# Altium schematic sheet ST_LINK_V2.SCHDOC: ST-LINK/V2 (SWD only)
size A4; DocumentNumber: 2; SheetNumber: 3; SheetTotal: 7
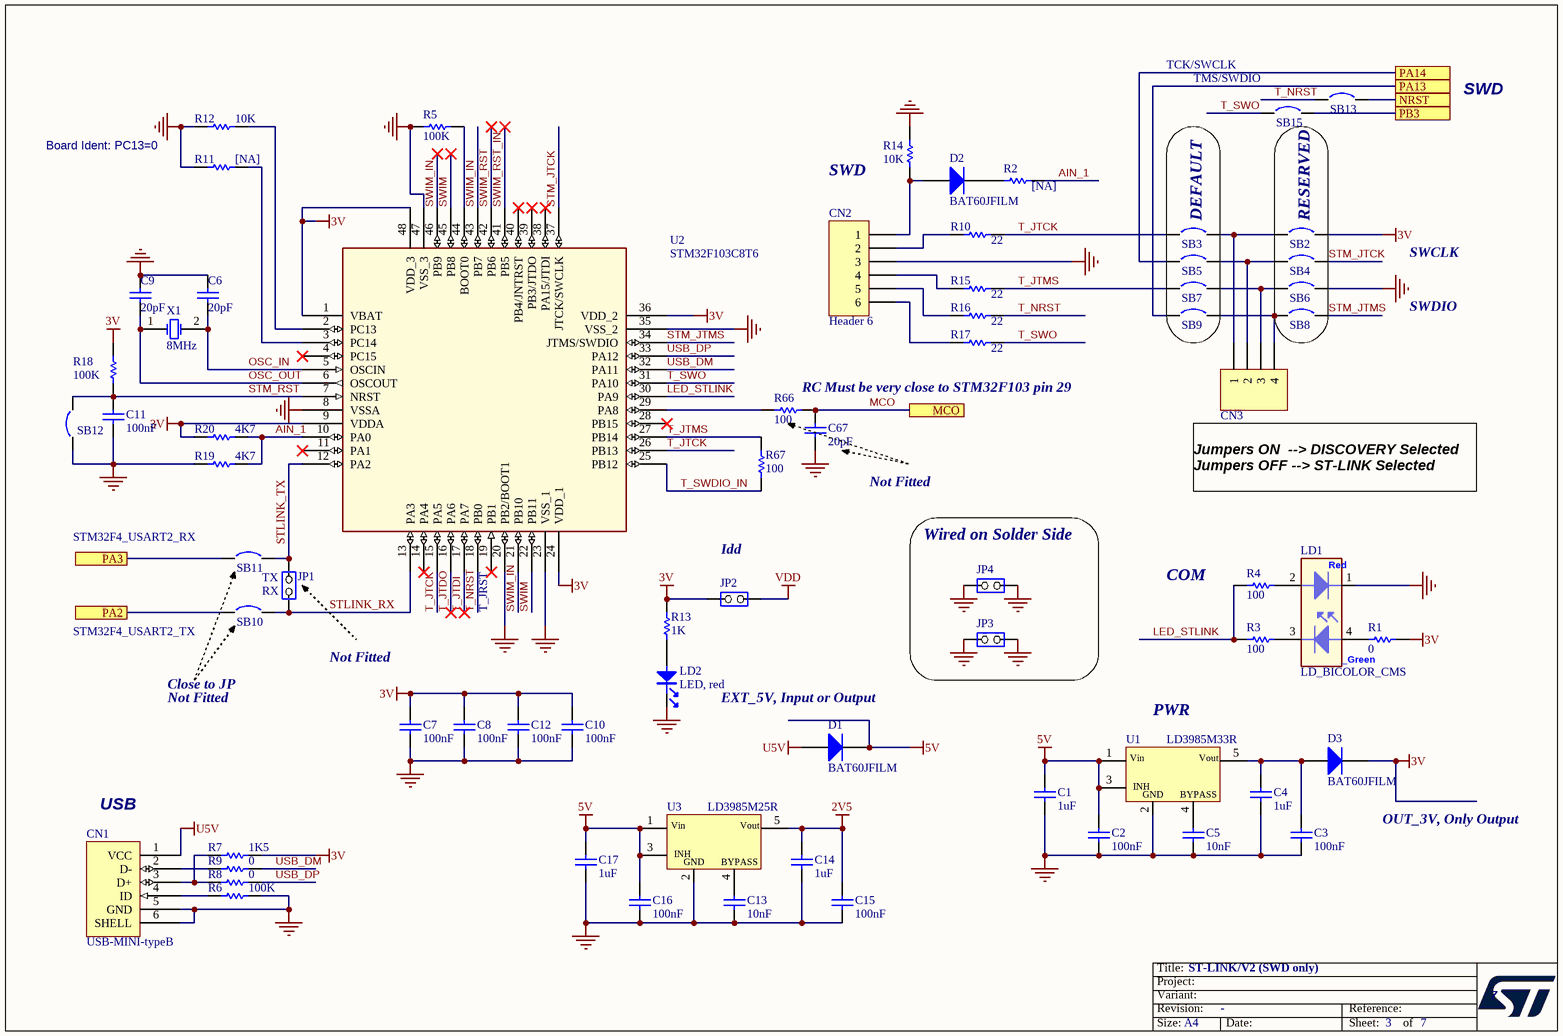
[diagram p0: ST_LINK_V2.SCHDOC]

## Parts
C1  1uF  [0603C (Primary)]
C2  100nF  [0402C (Primary)]
C3  100nF  [0402C (Primary)]
C4  1uF  [0603C (Primary)]
C5  10nF  [0603C (Primary)]
C6  20pF  [0402C (Primary)]
C7  100nF  [0402C (Primary)]
C8  100nF  [0402C (Primary)]
C9  20pF  [0402C (Primary)]
C10  100nF  [0402C (Primary)]
C11  100nF  [0402C (Primary)]
C12  100nF  [0402C (Primary)]
C13  10nF  [0603C (Primary)]
C14  1uF  [0603C (Primary)]
C15  100nF  [0402C (Primary)]
C16  100nF  [0402C (Primary)]
C17  1uF  [0603C (Primary)]
C67  20pF  [0402C (Primary)]
CN1  USB-MINI-typeB  [USB-MINI-B-SMD (Primary)]
CN2  Header 6  [HDR1X6 (Primary)]
CN3  Header 4  [Header 4 (Primary)]  (value not drawn)
D1  BAT60JFILM  [SOD323/A (Primary)]
D2  BAT60JFILM  [SOD323/A (Primary)]
D3  BAT60JFILM  [SOD323/A (Primary)]
JP1  JP2  [SIP2/2.54 (Primary)]  (value not drawn)
JP2  (no value)  [SIP2/2.54 (Primary)]
JP3  (no value)  [SIP2/2.54 (Primary)]
JP4  (no value)  [SIP2/2.54 (Primary)]
LD1  LD_BICOLOR_CMS  [HSMF-A201 (Primary)]
LD2  LED, red  [0603D (Primary)]
R1  0  [0402R (Primary)]
R2  [NA]  [0402R (Primary)]
R3  100  [0402R (Primary)]
R4  100  [0402R (Primary)]
R5  100K  [0402R (Primary)]
R6  100K  [0402R (Primary)]
R7  1K5  [0402R (Primary)]
R8  0  [0402R (Primary)]
R9  0  [0402R (Primary)]
R10  22  [0402R (Primary)]
R11  [NA]  [0402R (Primary)]
R12  10K  [0402R (Primary)]
R13  1K  [0402R (Primary)]
R14  10K  [0402R (Primary)]
R15  22  [0402R (Primary)]
R16  22  [0402R (Primary)]
R17  22  [0402R (Primary)]
R18  100K  [0402R (Primary)]
R19  4K7  [0402R (Primary)]
R20  4K7  [0402R (Primary)]
R66  100  [0402R (Primary)]
R67  100  [0402R (Primary)]
SB2  Circuit Breaker  [JP2_SMD (Primary)]  (value not drawn)
SB3  Circuit Breaker  [JP2_SMD (Primary)]  (value not drawn)
SB4  Circuit Breaker  [JP2_SMD (Primary)]  (value not drawn)
SB5  Circuit Breaker  [JP2_SMD (Primary)]  (value not drawn)
SB6  Circuit Breaker  [JP2_SMD (Primary)]  (value not drawn)
SB7  Circuit Breaker  [JP2_SMD (Primary)]  (value not drawn)
SB8  Circuit Breaker  [JP2_SMD (Primary)]  (value not drawn)
SB9  Circuit Breaker  [JP2_SMD (Primary)]  (value not drawn)
SB10  Circuit Breaker  [JP2_SMD (Primary)]  (value not drawn)
SB11  Circuit Breaker  [JP2_SMD (Primary)]  (value not drawn)
SB12  Circuit Breaker  [JP2_SMD (Primary)]  (value not drawn)
SB13  Circuit Breaker  [JP2_SMD (Primary)]  (value not drawn)
SB15  Circuit Breaker  [JP2_SMD (Primary)]  (value not drawn)
U1  LD3985M33R  [SOT-23-5L (Primary)]
U2  STM32F103C8T6  [LQFP48 (Primary)]
U3  LD3985M25R  [SOT-23-5L (Primary)]
X1  8MHz  [XTAL1 (Primary)]

## Blocks framed on the sheet
DEFAULT: SB3 SB5 SB7 SB9
RESERVED: SB2 SB4 SB6 SB8
Wired on Solder Side: JP3 JP4

## Ports
MCO, NRST, PA2, PA3, PA13, PA14, PB3

## Nets
2V5: C14.1 C15.2 U3.5(Vout)
3V: C7.2 C8.2 C10.2 C12.1 D3.2(K) JP2.1(COMMON) R1.2 R7.2 R13.2 R18.2 R20.1 SB2.2 U2.1(VBAT) U2.9(VDDA) U2.24(VDD_1) U2.36(VDD_2) U2.48(VDD_3)
5V: C1.2 C2.2 C16.2 C17.2 D1.2(K) U1.1(Vin) U1.3(CE) U3.1(Vin) U3.3(CE)
GND: C1.1 C2.1 C3.1 C4.2 C5.1 C6.1 C7.1 C8.1 C9.1 C10.1 C11.1 C12.2 C13.1 C14.2 C15.1 C16.1 C17.1 C67.2 CN1.5(GND) CN1.6(SHELL) CN2.3 JP3.1(COMMON) JP3.2(NO) JP4.1(COMMON) JP4.2(NO) LD1.1 LD2.2 R5.1 R6.2 R11.1 R12.1 R14.2 R19.1 SB6.2 SB12.1 U1.2(GND) U2.8(VSSA) U2.20(PB2/BOOT1) U2.23(VSS_1) U2.35(VSS_2) U2.47(VSS_3) U3.2(GND)
U5V: CN1.1(VCC) D1.1(A)
VDD: JP2.2(NO)
AIN_1: R2.2 R19.2 R20.2 U2.10(PA0)
LED_STLINK: R3.1 R4.1 U2.30(PA9)
MCO: C67.1 R66.2 ; port MCO
NRST: SB13.2 ; port NRST
OSC_IN: C6.2 U2.5(OSCIN) X1.2(OSC2)
OSC_OUT: C9.2 U2.6(OSCOUT) X1.1(OSC1)
PA2: SB10.1 ; port PA2
PA3: SB11.1 ; port PA3
PA13: SB9.1 ; port PA13
PA14: SB5.1 ; port PA14
PB3: SB15.2 ; port PB3
STLINK_RX: JP1.1(COMMON) SB10.2 U2.13(PA3)
STLINK_TX: JP1.2(NO) SB11.2 U2.12(PA2)
STM_JTCK: SB4.2 U2.37(JTCK/SWCLK)
STM_JTMS: SB8.2 U2.34(JTMS/SWDIO)
STM_RST: C11.2 R18.1 SB12.2 U2.7(NRST)
SWIM: U2.22(PB11) U2.45(PB8)
SWIM_IN: U2.21(PB10) U2.43(PB7) U2.46(PB9)
SWIM_RST: U2.42(PB6)
SWIM_RST_IN: U2.41(PB5)
T_JTCK: R10.2 SB3.1 U2.15(PA5) U2.26(PB13)
T_JTDI: U2.17(PA7)
T_JTDO: U2.16(PA6)
T_JTMS: R15.2 R67.2 SB7.1 U2.27(PB14)
T_NRST: R16.2 SB13.1 U2.18(PB0)
T_SWDIO_IN: R67.1 U2.25(PB12)
T_SWO: R17.2 SB15.1 U2.31(PA10)
USB_DM: R9.2 U2.32(PA11)
USB_DP: R8.2 U2.33(PA12)
NetC3_2: C3.2 C4.1 D3.1(A) U1.5(Vout)
NetC5_2: C5.2 U1.4(BYPASS)
NetC13_2: C13.2 U3.4(BYPASS)
NetCN1_2: CN1.2(D-) R9.1
NetCN1_3: CN1.3(D+) R7.1 R8.1
NetCN1_4: CN1.4(ID) R6.1
NetCN2_1: CN2.1 D2.1(A) R14.1
NetCN2_2: CN2.2 R10.1
NetCN2_4: CN2.4 R15.1
NetCN2_5: CN2.5 R16.1
NetCN2_6: CN2.6 R17.1
NetCN3_1: CN3.1 SB2.1 SB3.2
NetCN3_2: CN3.2 SB4.1 SB5.2
NetCN3_3: CN3.3 SB6.1 SB7.2
NetCN3_4: CN3.4 SB8.1 SB9.2
NetD2_2: D2.2(K) R2.1
NetLD1_2: LD1.2 R4.2
NetLD1_3: LD1.3 R3.2
NetLD1_4: LD1.4 R1.1
NetLD2_1: LD2.1 R13.1
NetR5_2: R5.2 U2.44(BOOT0)
NetR11_2: R11.2 U2.3(PC14)
NetR12_2: R12.2 U2.2(PC13)
NetR66_1: R66.1 U2.29(PA8)

Not connected (* = marked no-connect by the designer): U2 4(PC15)* 11(PA1)* 14(PA4)* 19(PB1)* 28(PB15)* 38(PA15/JTDI)* 39(PB3/JTDO)* 40(PB4/JNTRST)*

## Notes on the sheet
- TCK/SWCLK
- (near SB15) TMS/SWDIO
- SWD
- Board Ident: PC13=0
- SWCLK
- SWDIO
- (near R66) RC Must be very close to STM32F103 pin 29
- Not Fitted
- Jumpers ON  --> DISCOVERY Selected
  Jumpers OFF --> ST-LINK Selected
- STM32F4_USART2_RX
- TX
- (near JP2) Idd
- COM
- STM32F4_USART2_TX
- RX
- (near U2) T_JRST
- Close to JP
- EXT_5V, Input or Output
- (near U1) PWR
- (near CN1) USB
- OUT_3V, Only Output
- Title:
- Project:
- Size:
- Revision:
- Variant:
- A4
- -
- Date:
- Reference:
- Sheet:
- of
- (in symbol LD3985M25R) INH
- (in symbol LD3985M33R) INH
- (in symbol LD_BICOLOR_CMS) Red; _Green

## Library data of the parts
C1 C4 C14 C17 = Cap_1uF_X5R_10%_0603: Capacitor,1uF,16V,X5R,10%,0603,YAGEO; Manuf_Part_1: CC0603KRX5R7BB105; Revision: July-2002: Re-released for DXP Platform.; Value: 1uF; Order: CC0603KRX5R7BB105; Manuf_1: YAGEO
C2 C3 C7 C8 C10-C12 C15 C16 = Cap_100nF_X7R_10%_0402: Capacitor,100nF,16V,X7R,10%,0402,YAGEO; Manuf_Part_1: CC0402KRX7R7BB104; Revision: July-2002: Re-released for DXP Platform.; Value: 100nF; Order: CC0402KRX7R7BB104; Manuf_1: YAGEO
C5 C13 = Cap_10nF_X7R_10%_0603: Capacitor,10nF,50V,X7R,10%,0603,YAGEO; Manuf_Part_1: CC0603KRX7R9BB103; Revision: July-2002: Re-released for DXP Platform.; Value: 10nF; Order: CC0603KRX7R9BB103; Manuf_1: YAGEO
C6 C9 = Cap_20pF_NPO_5%_0402: Capacitor,20pF,50V,NPO,5%,0402,YAGEO; Order: CC0402JRNPO9BN200; Revision: July-2002: Re-released for DXP Platform.; Value: 20pF; Manuf_1: YAGEO; Manuf_Part_1: CC0402JRNPO9BN200
C67 = Cap_20pF_NPO_5%_0402: Capacitor,20pF,50V,NPO,5%,0402,YAGEO; Order: CC0402JRNPO9BN200; Fitted: NO; Revision: July-2002: Re-released for DXP Platform.; Value: 20pF; Manuf_1: YAGEO; Manuf_Part_1: CC0402JRNPO9BN200
CN1 = USB-MINI-typeB connector: Manuf_Part_1: 5075BMR-05-SM; Manuf_Part_2: 218205M1110T; Manuf_2: lyconn; Order: 5075BMR-05-SM
CN2 = Header 6: Header, 6-Pin; LatestRevisionDate: 17-Jul-2002; LatestRevisionNote: Re-released for DXP Platform.; Publisher: Altium Limited
CN3 = Header 4: Header, 4-Pin; Revision: 17-Jul-2002: Re-released for DXP Platform.; Publisher: Altium Limited
D1-D3 = BAT60JFILM: Manuf_1: STM; Provided: ST; ECCN_US/EU: EAR99/NEC; Ref St: 9151097; Revision: July-2002: Re-released for DXP Platform.; Order: BAT60JFILM; Manuf_Part_1: BAT60JFILM; Distrib: ST
JP1 = JP2: Fitted: NO
JP2-JP4 = JP2
LD1 = LD_BICOLOR_CMS: Bicolor Led; Manuf_Part_1: HSMF-A201-A00J1; Manuf_1: Avago Technologies; Manuf_2: everluck; Manuf_Part_2: LE-RGW35280; Ref St: xxxxxx; Distrib: RADIOSPARES; Footprint: HSMF-A201
LD2 = LED_red: LED, red, 0603; Manuf_1: everlight; Manuf_Part_1: 19-213-R6C-AP1Q2B/3T; Order: 19-213-R6C-AP1Q2B/3T
R1 R8 R9 = Res_0_0402: Resistor,0,0402; Value: 0
R2 R11 = Res_NA_0402: Resistor,[NA],0402; Fitted: NO; Value: [NA]
R3-R7 R10 R12-R20 R67 = res1: Resistor; Published: 8-Jun-2000; Revision: July-2002: Re-released for DXP Platform.; Publisher: Altium Limited
  R3 R4 R67: Value: 100
  R5 R6 R18: Value: 100K
  R7: Value: 1K5
  R10 R15-R17: Value: 22
  R12 R14: Value: 10K
  R13: Value: 1K
  R19 R20: Value: 4K7
R66 = res1: Resistor; Fitted: NO; Published: 8-Jun-2000; Revision: July-2002: Re-released for DXP Platform.; Publisher: Altium Limited; Value: 100
SB2 SB4 SB6 SB8 SB10-SB12 = Circuit Breaker: Solder: NO; Revision: July-2002: Re-released for DXP Platform.
SB3 SB5 SB7 SB9 SB13 SB15 = Circuit Breaker: Solder: YES; Revision: July-2002: Re-released for DXP Platform.
U1 = LD3985M33R: Ultra low drop-low noise BiCMOS voltage, regulators low ESR capacitors compatible; Manuf_1: STM; Provided: ST; Ref St: 9176161; ECCN_US/EU: EAR99/NEC; Manuf_Part_1: LD3985M33R; Distrib: ST; Order: LD3985M33R
U2 = STM32F103C8T6: Medium-density performance line ARM-based 32-bit MCU with 64KB Flash; Manuf_1: STM; Ref St: 9175981; Provided: ST; ECCN_US/EU: 3A991A2/NEC; Footprint: QFP48 7X7; Manuf_Part_1: STM32F103C8T6; Distrib: ST; Order: STM32F103C8T6
U3 = LD3985M25R: Ultra low drop-low noise BiCMOS voltage, regulators low ESR capacitors compatible; Manuf_1: STM; Provided: ST; Ref St: 9176007; ECCN_US/EU: EAR99/NEC; Manuf_Part_1: LD3985M25R; Order: LD3985M25R; Distrib: ST
X1 = XTAL_8MHZ_20PPM: Crystal Oscillator,8Mhz,20PF,20PPM,-10-70 degree,DIP,HC-49S; Manuf_Part_1: HC-49S-C20QSA-8.000MHZ; Order: HC-49S-C20QSA-8.000MHZ